# EAGLE design 452BRG (EAGLE 6.6.0)
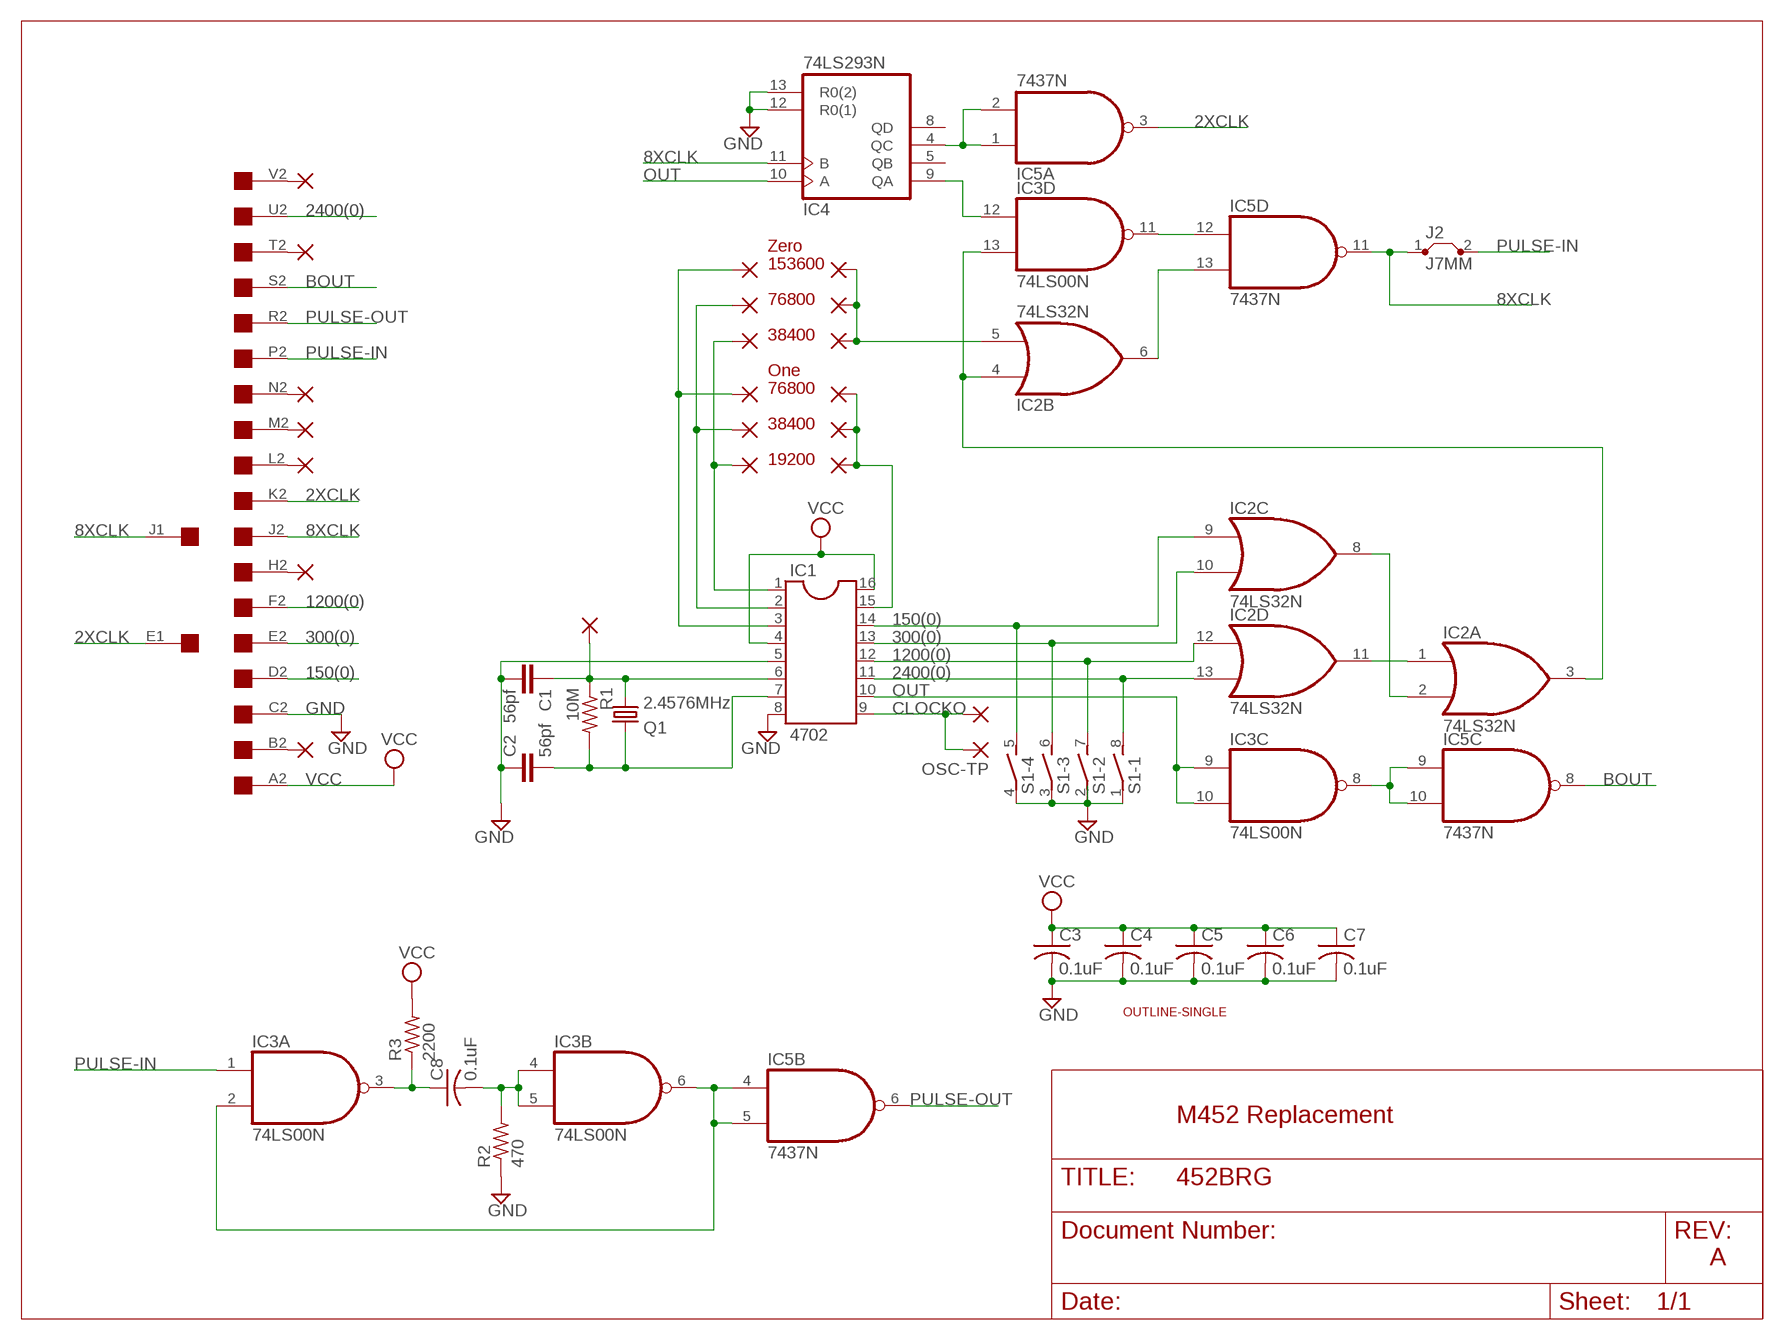
[diagram p0: schematic, sheet 1]

## Parts
C1  56pf  C-EU075-032X103  [C075-032X103]
C2  56pf  C-EU075-032X103  [C075-032X103]
C3  0.1uF  C-US075-032X103  [C075-032X103]
C4  0.1uF  C-US075-032X103  [C075-032X103]
C5  0.1uF  C-US075-032X103  [C075-032X103]
C6  0.1uF  C-US075-032X103  [C075-032X103]
C7  0.1uF  C-US075-032X103  [C075-032X103]
C8  0.1uF  C-US075-032X103  [C075-032X103]
IC1  4702  DIL16  [DIL16]
IC2  74LS32N  [DIL14]
IC3  74LS00N  [DIL14]
IC4  74LS293N  [DIL14]
IC5  7437N  [DIL14]
J2  J7MM  [07]
OSC-TP  1,6/0,8  [1,6/0,8]
PAD1  1,6/0,8  [1,6/0,8]
PAD2  1,6/0,8  [1,6/0,8]
PAD3  1,6/0,8  [1,6/0,8]
PAD4  1,6/0,8  [1,6/0,8]
PAD5  1,6/0,8  [1,6/0,8]
PAD6  1,6/0,8  [1,6/0,8]
PAD7  1,6/0,8  [1,6/0,8]
PAD8  1,6/0,8  [1,6/0,8]
PAD9  1,6/0,8  [1,6/0,8]
PAD10  1,6/0,8  [1,6/0,8]
PAD11  1,6/0,8  [1,6/0,8]
PAD12  1,6/0,8  [1,6/0,8]
PAD13  1,6/0,8  [1,6/0,8]
PAD14  1,6/0,8  [1,6/0,8]
PAD15  1,6/0,8  [1,6/0,8]
PAD16  1,6/0,8  [1,6/0,8]
PAD17  1,6/0,8  [1,6/0,8]
PAD18  1,6/0,8  [1,6/0,8]
PAD19  1,6/0,8  [1,6/0,8]
PAD20  1,6/0,8  [1,6/0,8]
Q1  2.4576MHz  CRYSTALHC49U-H  [HC49U-H]
R1  10M  R-US_0207/10  [0207/10]
R2  470  R-US_0207/12  [0207/12]
R3  2200  R-US_0207/15  [0207/15]
S1  DIP04S  [DIP04S]
U$2  SINGLE  [EDGE-CON2]
U$3  OUTLINE-SINGLE  [SINGLE]
XTAL  1,6/0,8  [1,6/0,8]

## Nets
2XCLK: IC5.3(A:O) U$2.E1 U$2.K2
8XCLK: IC4.11(B) IC5.11(D:O) J2.1 U$2.J1 U$2.J2
150(0): IC1.14 IC2.9(C:I0) S1.5 U$2.D2
300(0): IC1.13 IC2.10(C:I1) S1.6 U$2.E2
1200(0): IC1.12 IC2.12(D:I0) S1.7 U$2.F2
2400(0): IC1.11 IC2.13(D:I1) S1.8 U$2.U2
!OUT: IC3.8(C:O) IC5.9(C:I0) IC5.10(C:I1)
BOUT: IC5.8(C:O) U$2.S2
CLOCKO: IC1.9 OSC-TP.1(P) PAD20.1(P)
GND: C1.2 C2.1 C3.2 C4.2 C5.2 C6.2 C7.2 IC1.5 IC1.8 IC4.12(R0(1)) IC4.13(R0(2)) R2.1 S1.1 S1.2 S1.3 S1.4 U$2.C2
N$1: C2.2 IC1.7 Q1.1 R1.2
N$2: IC2.1(A:I0) IC2.11(D:O)
N$3: IC1.15 PAD4.1(P) PAD5.1(P) PAD6.1(P)
N$4: IC2.2(A:I1) IC2.8(C:O)
N$5: IC1.3 PAD1.1(P) PAD7.1(P)
N$6: IC1.1 PAD3.1(P) PAD9.1(P)
N$7: IC1.2 PAD2.1(P) PAD8.1(P)
N$8: IC2.3(A:O) IC2.4(B:I0) IC3.13(D:I1)
N$9: IC2.5(B:I1) PAD10.1(P) PAD11.1(P) PAD12.1(P)
N$10: IC4.4(QC) IC5.1(A:I0) IC5.2(A:I1)
N$11: IC3.12(D:I0) IC4.9(QA)
N$12: C8.2 IC3.4(B:I0) IC3.5(B:I1) R2.2
N$13: IC3.2(A:I1) IC3.6(B:O) IC5.4(B:I0) IC5.5(B:I1)
N$14: IC3.11(D:O) IC5.12(D:I0)
N$15: IC2.6(B:O) IC5.13(D:I1)
N$17: C8.1 IC3.3(A:O) R3.1
N$18: C1.1 IC1.6 Q1.2 R1.1 XTAL.1(P)
N$19: PAD13.1(P) U$2.V2
N$20: PAD14.1(P) U$2.T2
N$21: PAD15.1(P) U$2.N2
N$22: PAD16.1(P) U$2.M2
N$23: PAD17.1(P) U$2.L2
N$24: PAD18.1(P) U$2.H2
N$25: PAD19.1(P) U$2.B2
OUT: IC1.10 IC3.9(C:I0) IC3.10(C:I1) IC4.10(A)
PULSE-IN: IC3.1(A:I0) J2.2 U$2.P2
PULSE-OUT: IC5.6(B:O) U$2.R2
VCC: C3.1 C4.1 C5.1 C6.1 C7.1 IC1.4 IC1.16 R3.2 U$2.A2
Unconnected: IC4.5(QB) IC4.8(QD) U$2.A1 U$2.B1 U$2.C1 U$2.D1 U$2.F1 U$2.H1 U$2.K1 U$2.L1 U$2.M1 U$2.N1 U$2.P1 U$2.R1 U$2.S1 U$2.T1 U$2.U1 U$2.V1

## Notes on the sheet
- Zero
- 153600
- 76800
- 38400
- One
- 76800
- 38400
- 19200
- M452 Replacement
- A

## Power pins joined to a net without a drawn wire
GND: IC2.7(P:GND) IC3.7(P:GND) IC4.7(GND) IC5.7(P:GND)
VCC: IC2.14(P:VCC) IC3.14(P:VCC) IC4.14(VCC) IC5.14(P:VCC)

## Library data of the parts
C1 C2 = rcl:C-EU: CAPACITOR, European symbol
C3-C8 = rcl:C-US: CAPACITOR, American symbol
IC1 = ic-package:DIL16: Dual In Line / Socket
IC2 = 74xx-us:74*32: Quad 2-input OR gate
IC3 = 74xx-us:74*00: Quad 2-input NAND gate
IC4 = 74xx-us:74*293: Decade and 4-bit BINARY COUNTER
IC5 = 74xx-us:74*37: Quad 2-input NAND buffer
J2 = jumper:J: Bridge
OSC-TP PAD1-PAD20 XTAL = wirepad:1,6/0,8: THROUGH-HOLE PAD
Q1 = crystal:CRYSTAL: CRYSTAL; OC_FARNELL: 1666973; OC_NEWARK: unknown
R1-R3 = rcl:R-US_: RESISTOR, American symbol
S1 = switch-dil:DIP04S: DIL/CODE SWITCH; OC_FARNELL: unknown; OC_NEWARK: unknown
U$2 = dec-con:SINGLE: Single-Height DEC board
U$3 = dec-con:OUTLINE-*: Board outlines for DEC boards.

## Board
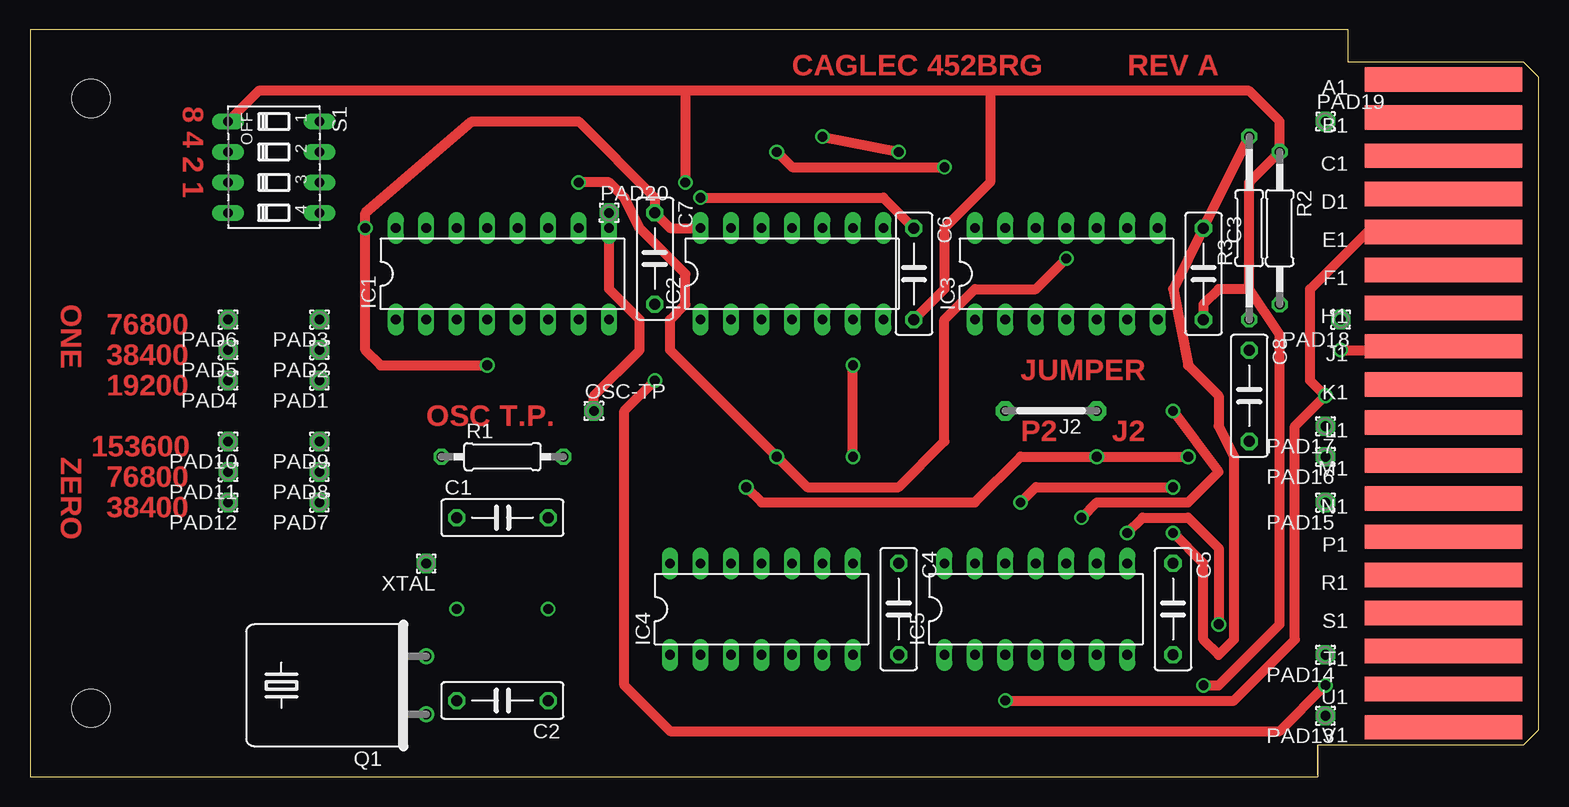
[diagram p1: board, top side]
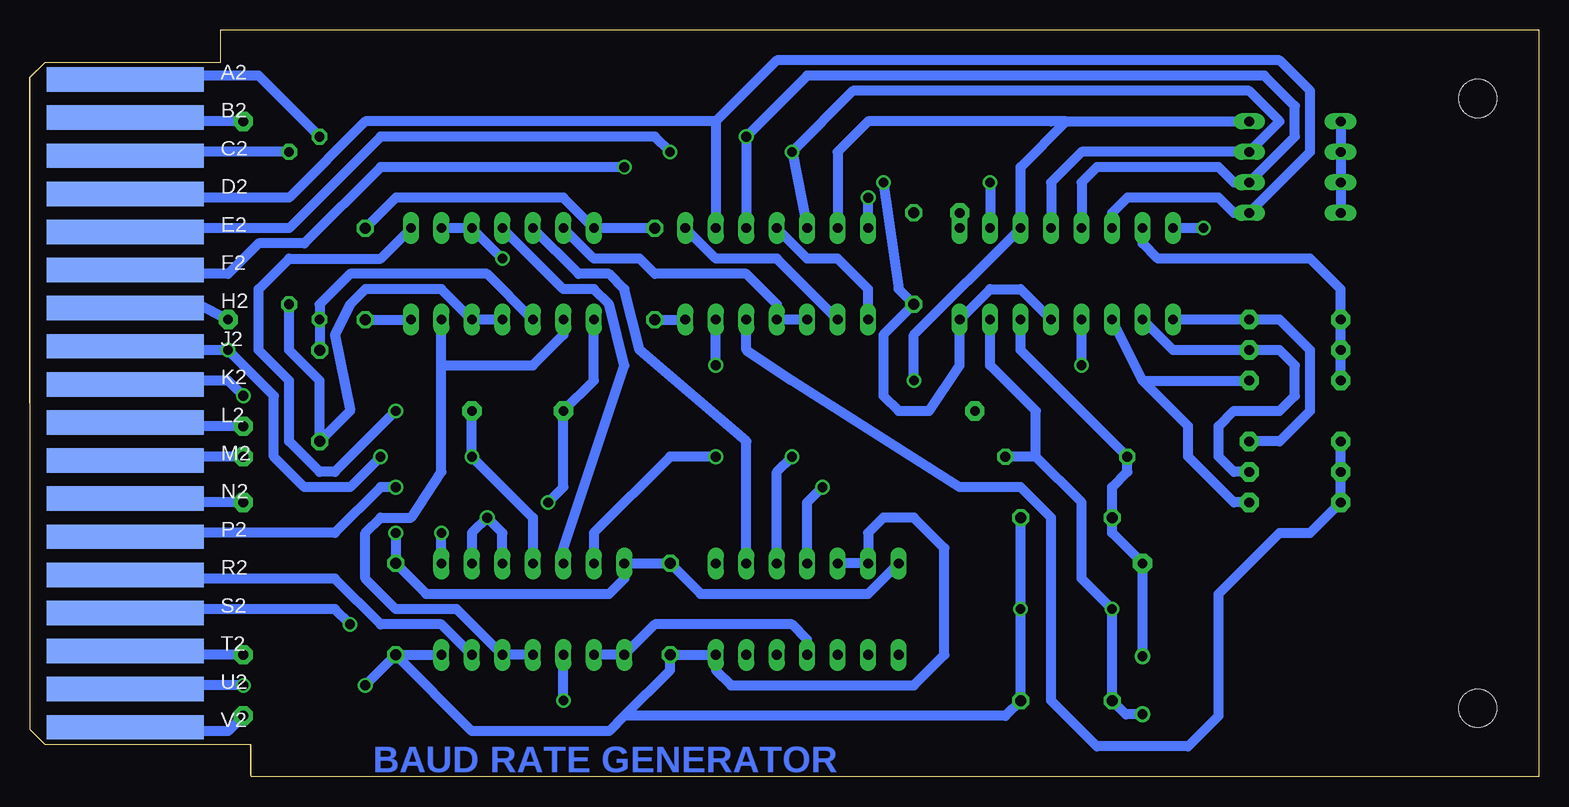
[diagram p2: board, bottom side, seen from below]

Size 125.73 x 62.23 mm. Coordinates in mm from the lower left corner, seen from the top.
Copper layers (1+16): Top 0.035mm / dielectric 1.5mm / Bottom 0.035mm
Design rules "16mils": minimum track width 16mil, minimum drill 32mil, track to track 15mil, track to pad 10mil, pad to pad 10mil, via to via 10mil, smd to smd 10mil, copper to edge 13mil, drill to drill 10mil, minimum pad ring 10mil, minimum via ring 8mil, stop-mask expansion 0mil, vias tented up to drill 0mil, thermal gap 10mil

### Footprints (pad centres in the part's own frame; a part is rotated, then mirrored left to right if it is on the bottom)
C075-032X103 = drill 0.914 octagon: 1 -3.81,0; 2 3.81,0
DIL16 = drill 0.813 long: 1 -8.89,-3.81; 2 -6.35,-3.81; 3 -3.81,-3.81; 4 -1.27,-3.81; 5 1.27,-3.81; 6 3.81,-3.81; 7 6.35,-3.81; 8 8.89,-3.81; 9 8.89,3.81; 10 6.35,3.81; 11 3.81,3.81; 12 1.27,3.81; 13 -1.27,3.81; 14 -3.81,3.81; 15 -6.35,3.81; 16 -8.89,3.81
DIL14 = drill 0.813 long: 1 -7.62,-3.81; 2 -5.08,-3.81; 3 -2.54,-3.81; 4 0,-3.81; 5 2.54,-3.81; 6 5.08,-3.81; 7 7.62,-3.81; 8 7.62,3.81; 9 5.08,3.81; 10 2.54,3.81; 11 0,3.81; 12 -2.54,3.81; 13 -5.08,3.81; 14 -7.62,3.81
07 = drill 0.813 pad 1.6 octagon: 1 -3.81,0; 2 3.81,0
1,6/0,8 = drill 0.813 pad 1.6 octagon: 1 0,0
HC49U-H = drill 0.813: 1 -2.413,-5.08; 2 2.413,-5.08
0207/10 = drill 0.813 octagon: 1 -5.08,0; 2 5.08,0
0207/12 = drill 0.813 octagon: 1 -6.35,0; 2 6.35,0
0207/15 = drill 0.813 octagon: 1 -7.62,0; 2 7.62,0
DIP04S = drill 0.813 long: 1 -3.81,-3.81; 2 -1.27,-3.81; 3 1.27,-3.81; 4 3.81,-3.81; 5 3.81,3.81; 6 1.27,3.81; 7 -1.27,3.81; 8 -3.81,3.81
EDGE-CON2 = smd 13.106 x 2.032: A1 7.938,4.128; B1 7.938,7.303; C1 7.938,10.477; D1 7.938,13.652; E1 7.938,16.828; F1 7.938,20.003; H1 7.938,23.177; J1 7.938,26.352; K1 7.938,29.527; L1 7.938,32.703; M1 7.938,35.877; N1 7.938,39.053; P1 7.938,42.227; R1 7.938,45.403; S1 7.938,48.578; T1 7.938,51.752; U1 7.938,54.928; V1 7.938,58.102 | smd 13.106 x 2.032 bottom: A2 7.938,4.128; B2 7.938,7.303; C2 7.938,10.477; D2 7.938,13.652; E2 7.938,16.828; F2 7.938,20.003; H2 7.938,23.177; J2 7.938,26.352; K2 7.938,29.527; L2 7.938,32.703; M2 7.938,35.877; N2 7.938,39.053; P2 7.938,42.227; R2 7.938,45.403; S2 7.938,48.578; T2 7.938,51.752; U2 7.938,54.928; V2 7.938,58.102
SINGLE = hole 3.175: 120.65,56.515; 120.65,5.715

### Placement (x,y rotation side)
C1  39.37,21.59 0 top
C2  39.37,6.35 180 top
C3  97.79,41.91 270 top
C4  72.39,13.97 270 top
C5  95.25,13.97 270 top
C6  73.66,41.91 270 top
C7  52.07,43.18 270 top
C8  101.6,31.75 270 top
IC1  39.37,41.91 0 top
IC2  63.5,41.91 0 top
IC3  86.36,41.91 0 top
IC4  60.96,13.97 0 top
IC5  83.82,13.97 0 top
J2  85.09,30.48 180 top
OSC-TP  46.99,30.48 0 top
PAD1  24.13,33.02 180 top
PAD2  24.13,35.56 180 top
PAD3  24.13,38.1 180 top
PAD4  16.51,33.02 180 top
PAD5  16.51,35.56 180 top
PAD6  16.51,38.1 180 top
PAD7  24.13,22.86 180 top
PAD8  24.13,25.4 180 top
PAD9  24.13,27.94 180 top
PAD10  16.51,27.94 180 top
PAD11  16.51,25.4 180 top
PAD12  16.51,22.86 180 top
PAD13  107.95,5.08 180 top
PAD14  107.95,10.16 180 top
PAD15  107.95,22.86 180 top
PAD16  107.95,26.67 180 top
PAD17  107.95,29.21 180 top
PAD18  109.22,38.1 180 top
PAD19  107.95,54.61 0 top
PAD20  48.26,46.99 0 top
Q1  27.94,7.62 90 top
R1  39.37,26.67 0 top
R2  104.14,45.72 270 top
R3  101.6,45.72 90 top
S1  20.32,50.8 270 top
U$2  125.73,62.23 180 top
U$3  125.73,62.23 180 top
XTAL  33.02,17.78 180 top

### Tracks (layer width: path | path; a pad name or v marks a point on that pad's centre or on a via)
2XCLK  (via drill 0.81)
  Top 0.813: v81.28,6.35 100.33,6.35 105.41,11.43 105.41,29.21 v107.95,31.75 106.68,33.02 106.68,40.64 111.76,45.72 116.84,45.72 117.17,45.39 U$2.E1
  Bottom 0.813: v81.28,6.35 IC5.3 | U$2.K2 117.14,32.72 116.84,33.02 109.22,33.02 v107.95,31.75
8XCLK  (via drill 0.81)
  Top 0.813: U$2.J1 117.17,35.89 116.84,35.56 v109.22,35.56 | v96.52,26.67 v88.9,26.67 82.55,26.67 78.74,22.86 60.96,22.86 v59.69,24.13
  Bottom 0.813: IC4.11 60.96,22.86 v59.69,24.13 | U$2.J1 117.17,35.89 116.84,35.56 v109.22,35.56 105.41,31.75 105.41,26.67 102.87,24.13 99.06,24.13 v96.52,26.67 | IC5.11 83.82,21.59 v88.9,26.67 J2.1
150(0)
  Bottom 0.813: IC1.14 35.56,46.99 34.29,48.26 26.67,48.26 25.4,46.99 S1.5 19.05,52.07 19.05,57.15 21.59,59.69 63.5,59.69 68.58,54.61 | 68.58,54.61 IC2.9 | U$2.D2 117.14,48.56 116.84,48.26 104.14,48.26 97.79,54.61 68.58,54.61
300(0)  (via drill 0.81)
  Top 0.813: v66.04,53.34 v72.39,52.07
  Bottom 0.813: IC1.13 38.1,49.53 36.83,50.8 26.67,50.8 25.4,49.53 S1.6 20.32,53.34 20.32,55.88 22.86,58.42 60.96,58.42 v66.04,53.34 IC2.10 | U$2.E2 117.17,45.39 116.84,45.72 104.14,45.72 96.52,53.34 73.66,53.34 v72.39,52.07
1200(0)  (via drill 0.81)
  Top 0.813: v76.2,50.8 63.5,50.8 v62.23,52.07
  Bottom 0.813: IC1.12 40.64,49.53 38.1,52.07 S1.7 21.59,54.61 24.13,57.15 57.15,57.15 v62.23,52.07 IC2.12 | U$2.F2 117.12,42.19 116.84,41.91 109.22,41.91 106.68,44.45 102.87,44.45 96.52,50.8 v76.2,50.8
2400(0)  (via drill 0.81)
  Top 0.813: v107.95,7.62 104.14,3.81 53.34,3.81 49.53,7.62 49.53,30.48 v52.07,33.02
  Bottom 0.813: U$2.U2 117.2,7.26 116.84,7.62 v107.95,7.62 | v52.07,33.02 52.07,36.83 IC1.11 43.18,50.8 39.37,54.61 | IC2.13 58.42,52.07 55.88,54.61 39.37,54.61 | 39.37,54.61 S1.8 | 39.37,54.61 40.64,54.61
!OUT  (via drill 0.81)
  Top 0.813: v87.63,21.59 88.9,22.86 96.52,22.86 99.06,25.4 v95.25,30.48
  Bottom 0.813: IC3.8 96.52,43.18 104.14,43.18 106.68,40.64 106.68,35.56 104.14,33.02 104.14,27.94 101.6,25.4 100.33,25.4 v95.25,30.48 | IC5.10 86.36,20.32 v87.63,21.59 88.9,20.32 IC5.9
BOUT  (via drill 0.81)
  Top 0.813: v99.06,12.7 99.06,19.05 96.52,21.59 92.71,21.59 v91.44,20.32
  Bottom 0.813: U$2.S2 117.14,13.66 116.84,13.97 100.33,13.97 v99.06,12.7 | IC5.8 v91.44,20.32
CLOCKO
  Top 0.813: OSC-TP.1 46.99,31.75 50.8,35.56 50.8,38.1 48.26,40.64 IC1.9
  Bottom 0.813: IC1.9 PAD20.1
GND  (via drill 0.81)
  Top 0.813: 80.01,57.15 101.6,57.15 104.14,54.61 R2.1 101.6,49.53 101.6,40.64 | 80.01,57.15 54.61,57.15 | 54.61,57.15 19.05,57.15 S1.1 | 101.6,40.64 104.14,36.83 104.14,12.7 99.06,7.62 v97.79,7.62 | C3.2 97.79,39.37 99.06,40.64 101.6,40.64 | 54.61,57.15 v54.61,49.53 | C6.2 76.2,40.64 76.2,45.72 80.01,49.53 80.01,57.15
  Bottom 0.813: U$2.C2 117.17,51.74 116.84,52.07 R2.1 | C1.2 v43.18,13.97 C2.1 44.45,5.08 76.2,5.08 | 76.2,5.08 72.39,8.89 C4.2 IC4.7 68.58,8.89 67.31,7.62 52.07,7.62 49.53,10.16 49.53,19.05 52.07,21.59 54.61,21.59 55.88,20.32 IC4.13 IC4.12 | 76.2,5.08 77.47,3.81 88.9,3.81 C5.2 | C5.2 IC5.7 | IC1.5 43.18,40.64 45.72,40.64 IC1.8 48.26,34.29 50.8,30.48 53.34,30.48 54.61,31.75 54.61,36.83 C7.2 53.34,40.64 v54.61,49.53 | S1.4 S1.3 S1.2 S1.1 | C5.2 v97.79,7.62 | C3.2 IC3.7 | C6.2 IC2.7
N$1  (via drill 0.81)
  Bottom 0.813: Q1.1 34.42,5.21 C2.2 v35.56,13.97 38.1,16.51 38.1,22.86 41.91,26.67 | 41.91,26.67 R1.2 | IC1.7 45.72,34.29 41.91,30.48 41.91,26.67
N$2
  Bottom 0.813: IC2.1 55.88,40.64 58.42,43.18 60.96,43.18 IC2.11
N$3
  Bottom 0.813: IC1.15 33.02,44.45 31.75,43.18 19.05,43.18 16.51,40.64 PAD6.1 PAD5.1 PAD4.1
N$4
  Bottom 0.813: IC2.2 63.5,43.18 68.58,43.18 IC2.8
N$5
  Bottom 0.813: 33.02,33.02 PAD1.1 | 33.02,33.02 IC1.3 | PAD7.1 25.4,22.86 29.21,26.67 29.21,29.21 33.02,33.02
N$6
  Bottom 0.813: IC1.1 PAD3.1 21.59,38.1 19.05,35.56 19.05,30.48 21.59,27.94 PAD9.1
N$7
  Bottom 0.813: IC1.2 30.48,35.56 PAD2.1 21.59,35.56 20.32,34.29 20.32,31.75 21.59,30.48 25.4,30.48 26.67,29.21 26.67,26.67 25.4,25.4 PAD8.1
N$8
  Bottom 0.813: IC2.3 IC2.4 63.5,39.37 66.04,41.91 73.66,41.91 74.93,43.18 78.74,43.18 IC3.13
N$9
  Bottom 0.813: PAD10.1 PAD11.1 PAD12.1 19.05,20.32 21.59,20.32 26.67,15.24 26.67,5.08 29.21,2.54 36.83,2.54 40.64,6.35 40.64,21.59 43.18,24.13 48.26,24.13 62.23,33.02 66.04,35.56 IC2.5
N$10
  Bottom 0.813: IC5.2 IC5.1 73.66,12.7 62.23,12.7 60.96,11.43 IC4.4
N$11
  Bottom 0.813: IC4.9 66.04,27.94 74.93,35.56 76.2,40.64 77.47,41.91 80.01,41.91 IC3.12
N$12
  Bottom 0.813: IC3.4 IC3.5 91.44,40.64 97.79,40.64 99.06,39.37 100.33,36.83 99.06,30.48 C8.2 101.6,33.02 104.14,35.56 R2.2
N$13
  Bottom 0.813: IC3.2 81.28,36.83 83.82,34.29 91.44,34.29 | 91.44,34.29 IC3.6 | IC5.4 IC5.5 90.17,13.97 95.25,13.97 97.79,16.51 97.79,20.32 96.52,21.59 93.98,21.59 91.44,25.4 91.44,34.29
N$14
  Bottom 0.813: IC5.12 81.28,19.05 76.2,34.29 77.47,39.37 78.74,40.64 81.28,40.64 IC3.11
N$15  (via drill 0.81)
  Top 0.813: v68.58,26.67 v68.58,34.29
  Bottom 0.813: IC5.13 78.74,20.32 72.39,26.67 v68.58,26.67 | v68.58,34.29 IC2.6
N$17
  Bottom 0.813: C8.1 R3.1 101.6,39.37 99.06,41.91 87.63,41.91 IC3.3
N$18
  Bottom 0.813: IC1.6 43.18,35.56 R1.1 34.29,25.4 35.56,24.13 C1.1 35.56,20.32 XTAL.1 Q1.2
N$19
  Bottom 0.813: U$2.V2 117.23,4.2 116.84,3.81 109.22,3.81 PAD13.1
N$20
  Bottom 0.813: U$2.T2 117.17,10.49 116.84,10.16 PAD14.1
N$21
  Bottom 0.813: U$2.N2 117.17,23.19 116.84,22.86 PAD15.1
N$22
  Bottom 0.813: U$2.M2 117.17,26.34 116.84,26.67 PAD16.1
N$23
  Bottom 0.813: U$2.L2 117.17,29.54 116.84,29.21 PAD17.1
N$24
  Bottom 0.813: U$2.H2 117.17,39.04 116.84,39.37 111.76,39.37 PAD18.1
N$25
  Bottom 0.813: U$2.B2 117.13,54.9 116.84,54.61 PAD19.1
OUT  (via drill 0.81)
  Top 0.813: v45.72,49.53 48.26,49.53 49.53,48.26 50.8,45.72 54.61,41.91 54.61,39.37 53.34,38.1 53.34,35.56 v62.23,26.67 64.77,24.13 72.39,24.13 76.2,27.94 76.2,38.1 78.74,40.64 83.82,40.64 v86.36,43.18
  Bottom 0.813: v45.72,49.53 IC1.10 | IC4.10 63.5,25.4 v62.23,26.67 | IC3.9 IC3.10 v86.36,43.18
PULSE-IN  (via drill 0.81)
  Top 0.813: v82.55,22.86 83.82,24.13 v95.25,24.13
  Bottom 0.813: IC3.1 78.74,33.02 J2.2 81.28,24.13 v82.55,22.86 | U$2.P2 117.17,19.99 116.84,20.32 100.33,20.32 96.52,24.13 v95.25,24.13
PULSE-OUT
  Bottom 0.813: IC5.6 91.44,12.7 96.52,12.7 100.33,16.51 116.84,16.51 117.17,16.84 U$2.R2
VCC  (via drill 0.81)
  Top 0.813: v38.1,34.29 29.21,34.29 27.94,35.56 v27.94,45.72 27.94,46.99 36.83,54.61 44.45,54.61 45.72,54.61 52.07,48.26 C7.1 53.34,45.72 IC2.14 | R3.2 C3.1 95.25,40.64 96.52,34.29 99.06,31.75 99.06,29.21 100.33,26.67 100.33,11.43 99.06,10.16 97.79,11.43 97.79,17.78 v95.25,20.32 | C6.1 71.12,48.26 v55.88,48.26
  Bottom 0.813: R3.2 106.68,58.42 116.84,58.42 117.24,58.02 U$2.A2 | IC4.14 55.88,15.24 69.85,15.24 C4.1 IC5.14 76.2,16.51 77.47,15.24 92.71,15.24 C5.1 v95.25,20.32 | v27.94,45.72 IC1.16 | v38.1,34.29 IC1.4 | C6.1 IC3.14 81.28,48.26 95.25,48.26 C3.1 | IC2.14 v55.88,48.26

### Text on the board
Top: CAGLEC 452BRG | REV A | 8 4 2 1 | ONE | 76800 | 38400 | JUMPER | 19200 | OSC T.P. | P2 | J2 | ZERO | 153600 | 76800 | 38400
Bottom: BAUD RATE GENERATOR